# Altium schematic sheet ESP32_GATEWAY.SchDoc: ESP32 GATEWAY
size A3; Date: 30/1/2025; CheckedBy: Le Viet Trong; DrawnBy: Le Viet Trong; DocumentNumber: 1; SheetNumber: 1; SheetTotal: 1
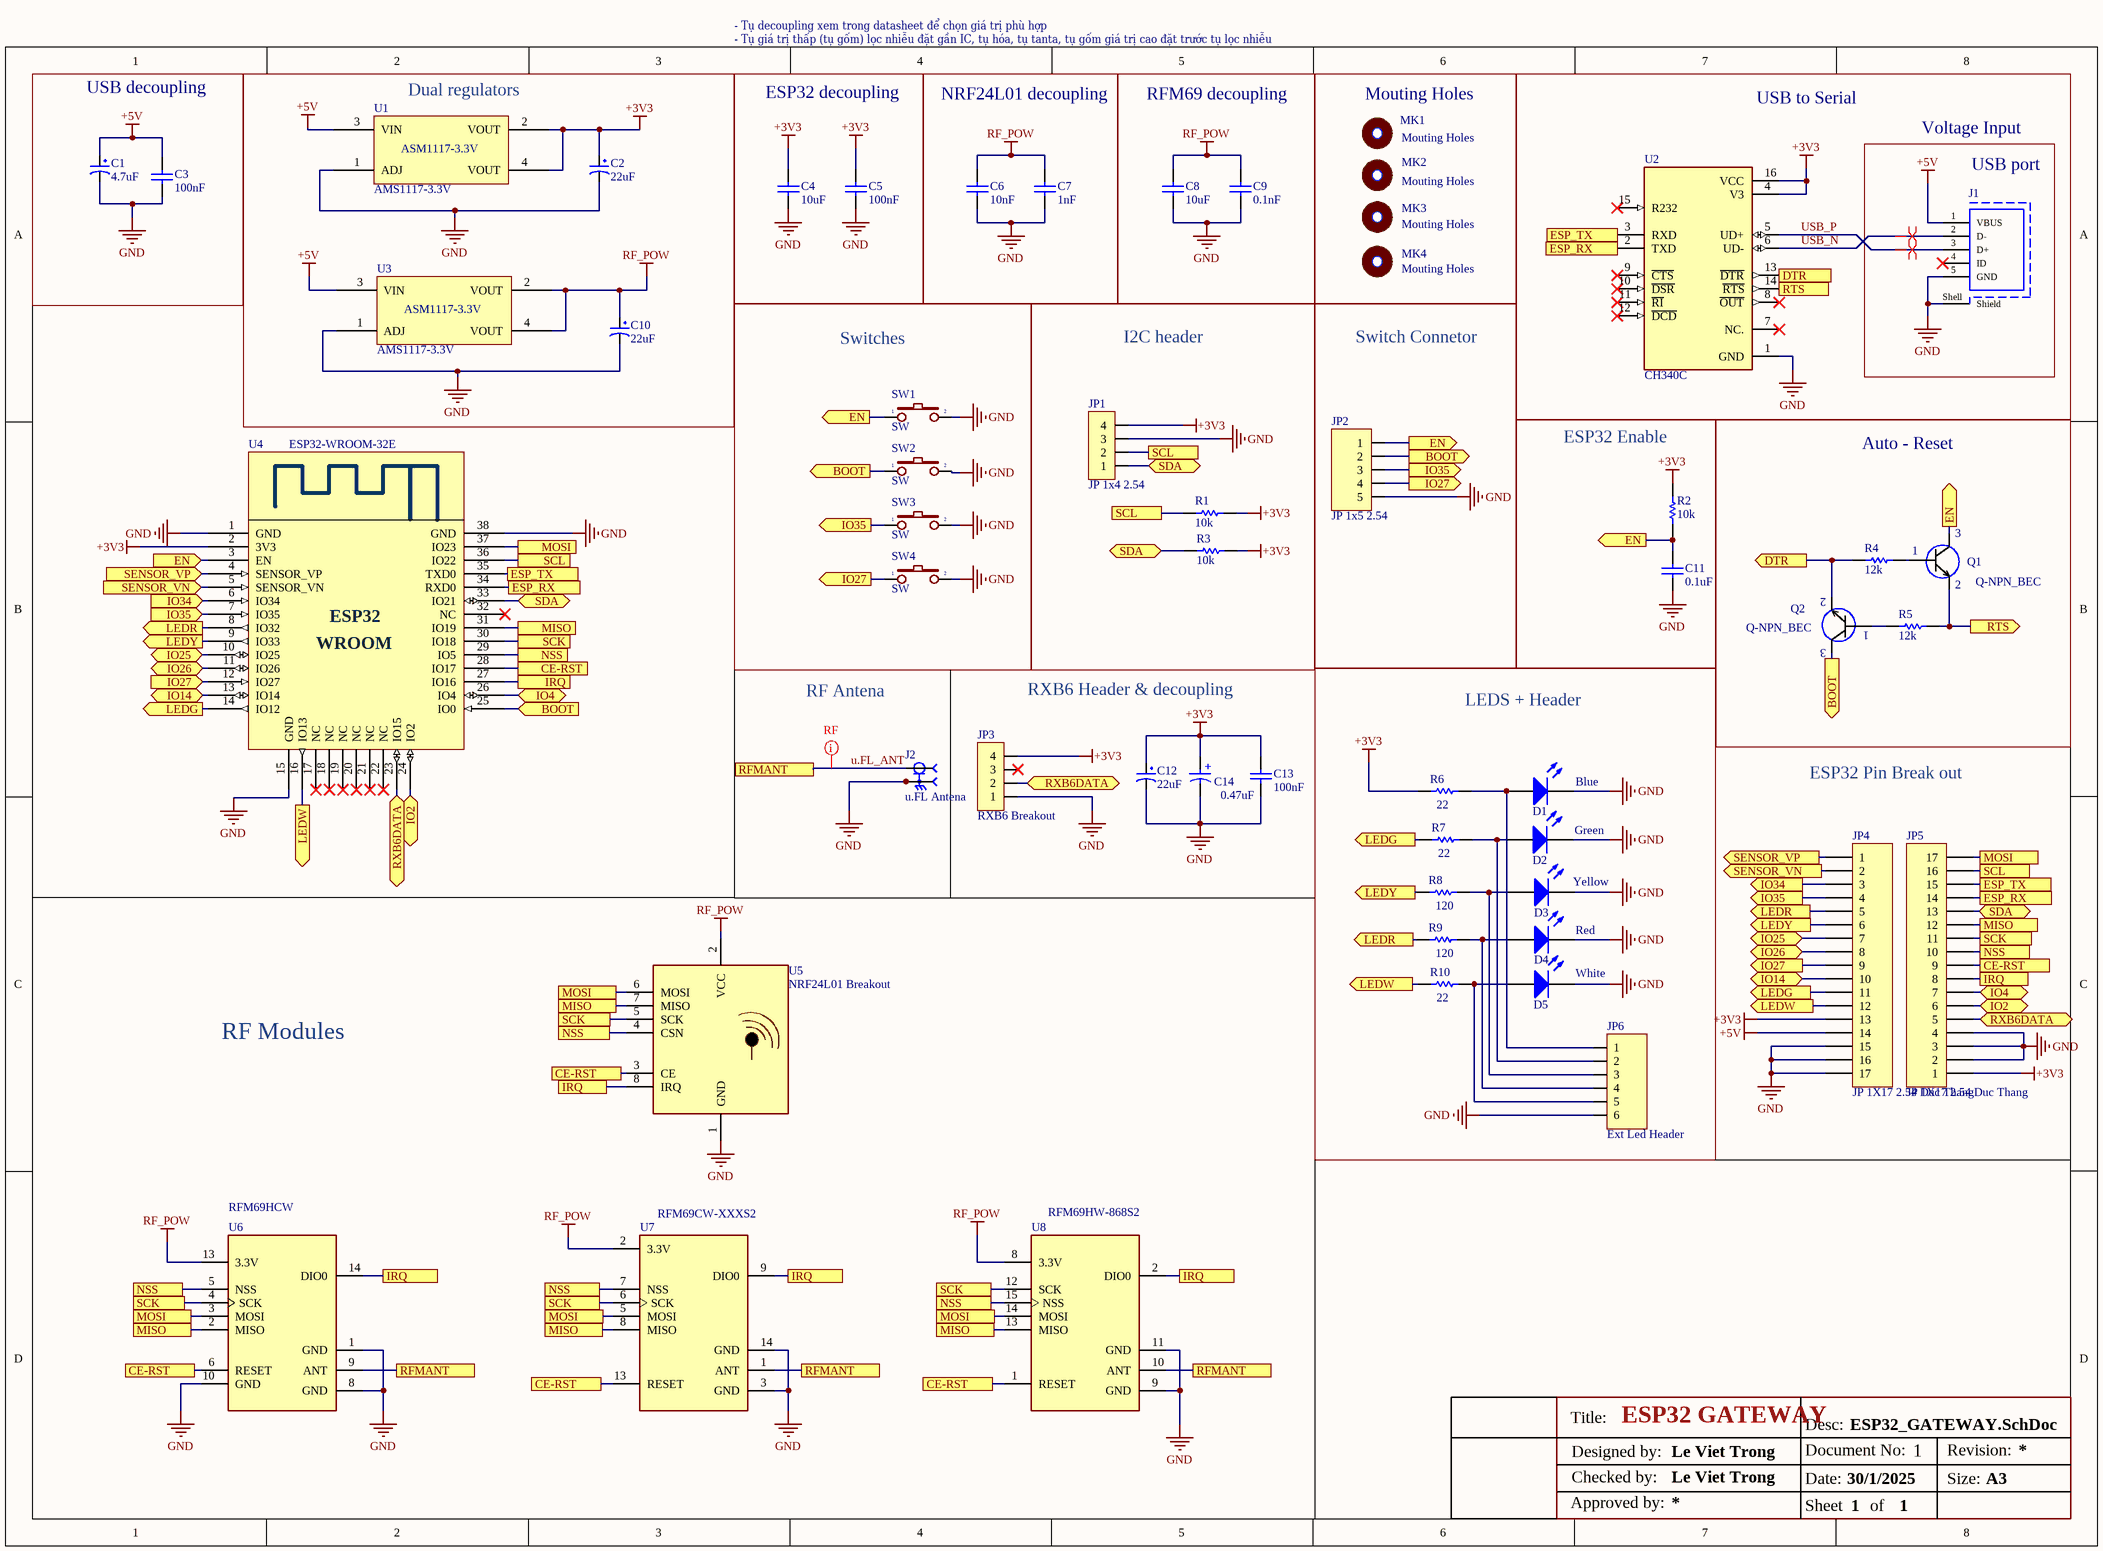
[diagram p0: ESP32_GATEWAY.SchDoc]

## Parts
C1  4.7uF  [Tu tanta 1206]
C2  22uF  [Tu tanta 1206]
C3  100nF  [CAP_0603]
C4  10uF  [CAP_0603]
C5  100nF  [CAP_0603]
C6  10nF  [CAP_0603]
C7  1nF  [CAP_0603]
C8  10uF  [CAP_0603]
C9  0.1nF  [CAP_0603]
C10  22uF  [Tu tanta 1206]
C11  0.1uF  [CAP_0603]
C12  22uF  [Tu tanta 1206]
C13  100nF  [CAP_0603]
C14  0.47uF  [WCAP-ASLI_D4H5.5]
D1  Blue  [LED_0805_Blue]
D2  Green  [LED_0805_Blue]
D3  Yellow  [LED_0805_Blue]
D4  Red  [LED_0805_Blue]
D5  White  [LED_0805_Blue]
J1  629105150521  [629105150521]  (value not drawn)
J2  u.FL Antena  [MOLEX_73412-0110]
JP1  JP 1x4 2.54  [JP 1X4 DT]
JP2  JP 1x5 2.54  [JP 1X5 DT]
JP3  RXB6 Breakout  [JP 1X4 DT]
JP4  JP 1X17 2.54 Duc Thang  [JP 1x17 DT]
JP5  JP 1X17 2.54 Duc Thang  [JP 1x17 DT]
JP6  Ext Led Header  [JP 1x6 DT]
MK1  Mouting Holes  [3mm]
MK2  Mouting Holes  [3mm]
MK3  Mouting Holes  [3mm]
MK4  Mouting Holes  [3mm]
Q1  Q-NPN_BEC  [SOT-23]
Q2  Q-NPN_BEC  [SOT-23]
R1  10k  [resistor_0603]
R2  10k  [resistor_0603]
R3  10k  [resistor_0603]
R4  12k  [resistor_0603]
R5  12k  [resistor_0603]
R6  22  [resistor_0603]
R7  22  [resistor_0603]
R8  120  [resistor_0603]
R9  120  [resistor_0603]
R10  22  [resistor_0603]
SW1  SW  [SW1-SMD]
SW2  SW  [SW1-SMD]
SW3  SW  [SW1-SMD]
SW4  SW  [SW1-SMD]
U1  AMS1117-3.3V  [AMS1117-3.3V SOT223]
U2  CH340C  [SOIC127P600X180-16N]
U3  AMS1117-3.3V  [AMS1117-3.3V SOT223]
U4  ESP32-WROOM-32E  [ESP32-WROOM]
U5  NRF24L01 Breakout  [NRF24L01 Breakout]
U6  RFM69HCW  [MOD_COM-13909]
U7  RFM69CW-XXXS2  [RFM69CW]
U8  RFM69HW-868S2  [XCVR_RFM69HW-868S2]

## Blocks framed on the sheet
USB decoupling: C1 C3
Dual regulators: C2 C10 U1 U3
ESP32 decoupling: C4 C5
NRF24L01 decoupling: C6 C7
RFM69 decoupling: C8 C9 MK1-MK4
Switches: SW1-SW4
I2C header: JP1 R1 R3
Switch Connetor: JP2
ESP32 Enable: C11 R2
Auto - Reset: Q1 Q2 R4 R5
LEDS + Header: D1-D5 JP6 R6-R10

## Ports
BOOT (in), BOOT (out), CE-RST, DTR (out), EN (in), EN (out), ESP_RX, ESP_TX, IO2 (bidir), IO4 (bidir), IO14 (bidir), IO25 (bidir), IO26 (bidir), IO27 (in), IO27 (out), IO34 (in), IO34 (out), IO35 (in), IO35 (out), IRQ, LEDG (out), LEDR (out), LEDW (out), LEDY (out), MISO, MOSI, NSS, RFMANT, RTS (out), RXB6DATA (bidir), SCK, SCL, SDA (bidir), SENSOR_VN (in), SENSOR_VN (out), SENSOR_VP (in), SENSOR_VP (out)

## Nets
+3V3: C2.1 C4.2 C5.2 C12.1 C13.2 C14.1(P) JP1.4 JP3.4 JP4.13 JP5.1 R1.2 R2.2 R3.2 R6.1 U1.2(VOUT) U1.4(VOUT) U2.4(V3) U2.16(VCC) U4.2(3V3)
+5V: C1.1 C3.2 J1.1(VBUS) JP4.14 U1.3(VIN) U3.3(VIN)
GND: C1.2 C2.2 C3.1 C4.1 C5.1 C6.1 C7.1 C8.1 C9.1 C10.2 C11.2 C12.2 C13.1 C14.2(N) D1.2(K) D2.2(K) D3.2(K) D4.2(K) D5.2(K) J1.5(GND) J1.Shell(Shield) J2.2(GND) J2.3(GND) J2.4(GND) JP1.3 JP2.5 JP3.1 JP4.15 JP4.16 JP4.17 JP5.2 JP5.3 JP5.4 JP6.6 SW1.2 SW2.2 SW3.2 SW4.2 U1.1(ADJ) U2.1(GND) U3.1(ADJ) U4.1(GND) U4.15(GND) U4.38(GND) U5.1(GND) U6.1(GND) U6.8(GND) U6.10(GND) U7.3(GND) U7.14(GND) U8.9(GND) U8.11(GND)
RF_POW: C6.2 C7.2 C8.2 C9.2 C10.1 U3.2(VOUT) U3.4(VOUT) U5.2(VCC) U6.13(3.3V) U7.2(3.3V) U8.8(3.3V)
BOOT: JP2.2 Q2.3 SW2.1 U4.25(IO0) ; port BOOT
CE-RST: JP5.9 U4.28(IO17) U5.3(CE) U6.6(RESET) U7.13(RESET) U8.1(RESET) ; port CE-RST
DTR: Q2.2 R4.1 U2.13(~{DTR}) ; port DTR
EN: C11.1 JP2.1 Q1.3 R2.1 SW1.1 U4.3(EN) ; port EN
ESP_RX: JP5.14 U2.2(TXD) U4.34(RXD0) ; port ESP_RX
ESP_TX: JP5.15 U2.3(RXD) U4.35(TXD0) ; port ESP_TX
IO2: JP5.6 U4.24(IO2) ; port IO2
IO4: JP5.7 U4.26(IO4) ; port IO4
IO14: JP4.10 U4.13(IO14) ; port IO14
IO25: JP4.7 U4.10(IO25) ; port IO25
IO26: JP4.8 U4.11(IO26) ; port IO26
IO27: JP2.4 JP4.9 SW4.1 U4.12(IO27) ; port IO27
IO34: JP4.3 U4.6(IO34) ; port IO34
IO35: JP2.3 JP4.4 SW3.1 U4.7(IO35) ; port IO35
IRQ: JP5.8 U4.27(IO16) U5.8(IRQ) U6.14(DIO0) U7.9(DIO0) U8.2(DIO0) ; port IRQ
LEDG: JP4.11 R7.1 U4.14(IO12) ; port LEDG
LEDR: JP4.5 R9.1 U4.8(IO32) ; port LEDR
LEDW: JP4.12 R10.1 U4.16(IO13) ; port LEDW
LEDY: JP4.6 R8.1 U4.9(IO33) ; port LEDY
MISO: JP5.12 U4.31(IO19) U5.7(MISO) U6.2(MISO) U7.8(MISO) U8.13(MISO) ; port MISO
MOSI: JP5.17 U4.37(IO23) U5.6(MOSI) U6.3(MOSI) U7.5(MOSI) U8.14(MOSI) ; port MOSI
NSS: JP5.10 U4.29(IO5) U5.4(CSN) U6.5(NSS) U7.7(NSS) U8.15(NSS) ; port NSS
RTS: Q1.2 R5.2 U2.14(~{RTS}) ; port RTS
RXB6DATA: JP3.2 JP5.5 U4.23(IO15) ; port RXB6DATA
SCK: JP5.11 U4.30(IO18) U5.5(SCK) U6.4(SCK) U7.6(SCK) U8.12(SCK) ; port SCK
SCL: JP1.2 JP5.16 R1.1 U4.36(IO22) ; port SCL
SDA: JP1.1 JP5.13 R3.1 U4.33(IO21) ; port SDA
SENSOR_VN: JP4.2 U4.5(SENSOR_VN) ; port SENSOR_VN
SENSOR_VP: JP4.1 U4.4(SENSOR_VP) ; port SENSOR_VP
u.FL_ANT: J2.1(SIG) U6.9(ANT) U7.1(ANT) U8.10(ANT) ; port RFMANT
USB_N: J1.2(D-) U2.6(UD-)
USB_P: J1.3(D+) U2.5(UD+)
NetD1_1: D1.1(A) D2.1(A) JP6.1 JP6.2 R6.2 R7.2
NetD3_1: D3.1(A) JP6.3 R8.2
NetD4_1: D4.1(A) JP6.4 R9.2
NetD5_1: D5.1(A) JP6.5 R10.2
NetQ1_1: Q1.1(B) R4.2
NetQ2_1: Q2.1(B) R5.1

Not connected (* = marked no-connect by the designer): J1 4(ID)*; JP3 3*; U2 7(NC.)* 8(~{OUT})* 9(~{CTS})* 10(~{DSR})* 11(~{RI})* 12(~{DCD})* 15(R232)*; U4 17(NC)* 18(NC)* 19(NC)* 20(NC)* 21(NC)* 22(NC)* 32(NC)*

## Layout directives
differential pair: USB_N, USB_P
mark named RF: u.FL_ANT

## Notes on the sheet
- - Tụ decoupling xem trong datasheet để chọn giá trị phù hợp
- - Tụ giá trị thấp (tụ gốm) lọc nhiễu đặt gần IC, tụ hóa, tụ tanta, tụ gốm giá trị cao đặt trước tụ lọc nhiễu
- Mouting Holes
- USB to Serial
- Voltage Input
- (near J1) USB port
- RXB6 Header & decoupling
- RF Antena
- ESP32 Pin Break out
- RF Modules
- 1
- Title:
- Desc:
- Designed by:
- Checked by:
- Date:
- Document No:
- Revision:
- Size:
- A3
- Approved by:
- Sheet
- of
- (in symbol 865080340003) +
- (in symbol AMS1117-3.3V) ASM1117-3.3V
- (in symbol ESP32-WROOM) WROOM

## Library data of the parts
C1 C2 C10 C12 = Tu tantalum 33uF 6.3V SMD3216: Dán; Don_Vi: Con; So_Chan: 2; Ten_Linh_Kien: Tụ tantalum J336-33uF 6.3V SMD3216; Ma_Hang: MH008674; Chung_Loai: Dán; Kieu_Chan: *
C3 C5 C13 = 01060310410: CAP, size 0603, 100nF; Supply 1 SN: 885012206095; Supply 1 name: Wurth Elektronik; Supply 2 name: Thegioiic; Capacitance Tolerance: +/-10%; ComponentLink1Description: Manufacturer; ComponentLink1URL: http://www.we-online.de; ComponentLink2Description: Datasheet; ComponentLink2URL: https://www.we-online.com/catalog/datasheet/885012206095.pdf; Operating Temperature: -55 to +125degC; Packaging: Tape and Reel; Supply 1 URL: https://www.we-online.com/en/components/products/WCAP-CSGP-50VDC?sq=885012206095R#885012206095R; Supply 2 SN: *; Supply 2 URL: https://www.thegioiic.com/tu-gom-0603-100nf-0-1uf-50v; Dissipation Factor: *; Height: *; Mounting Technology: SMT; Size: 0603; Capacitance: 100nF; Technical Reference: *
C4 C8 = 01060310010: CAP, size 0603,10uF; Supply 2 name: Thegioiic; Capacitance Tolerance: +/-10%; ComponentLink1Description: Manufacturer; ComponentLink1URL: *; ComponentLink2Description: Datasheet; ComponentLink2URL: *; Operating Temperature: -55 to +125degC; Packaging: Tape and Reel; Supply 1 SN: *; Supply 1 name: *; Supply 1 URL: *; Supply 2 SN: *; Supply 2 URL: https://www.thegioiic.com/tu-gom-0603-10uf-16v; Dissipation Factor: *; Height: *; Mounting Technology: SMT; Size: 0603; Capacitance: 10uF; Technical Reference: *
C6 = 01060310010: CAP, size 0603,10nF; Supply 2 name: Thegioiic; Capacitance Tolerance: +/-10%; Capacitance: 10uF; ComponentLink1Description: Manufacturer; ComponentLink1URL: *; ComponentLink2Description: Datasheet; ComponentLink2URL: *; Operating Temperature: -55 to +125degC; Packaging: Tape and Reel; Supply 1 SN: *; Supply 1 name: *; Supply 1 URL: *; Supply 2 SN: *; Supply 2 URL: https://www.thegioiic.com/tu-gom-0603-10uf-16v; Dissipation Factor: *; Height: *; Mounting Technology: SMT; Size: 0603; Technical Reference: *
C7 = 01060310010: CAP, size 0603,1nF; Supply 2 name: Thegioiic; Capacitance Tolerance: +/-10%; Capacitance: 10uF; ComponentLink1Description: Manufacturer; ComponentLink1URL: *; ComponentLink2Description: Datasheet; ComponentLink2URL: *; Operating Temperature: -55 to +125degC; Packaging: Tape and Reel; Supply 1 SN: *; Supply 1 name: *; Supply 1 URL: *; Supply 2 SN: *; Supply 2 URL: https://www.thegioiic.com/tu-gom-0603-10uf-16v; Dissipation Factor: *; Height: *; Mounting Technology: SMT; Size: 0603; Technical Reference: *
C9 C11 = 01060310010: CAP, size 0603, 0.1uF; Supply 2 name: Thegioiic; Capacitance Tolerance: +/-10%; Capacitance: 10uF; ComponentLink1Description: Manufacturer; ComponentLink1URL: *; ComponentLink2Description: Datasheet; ComponentLink2URL: *; Operating Temperature: -55 to +125degC; Packaging: Tape and Reel; Supply 1 SN: *; Supply 1 name: *; Supply 1 URL: *; Supply 2 SN: *; Supply 2 URL: https://www.thegioiic.com/tu-gom-0603-10uf-16v; Dissipation Factor: *; Height: *; Mounting Technology: SMT; Size: 0603; Technical Reference: *
C14 = 865080340003: V-Chip, D4 x H5.5mm, 22uF, 16V; Capacitance Tolerance: +/-20%; Dissipation Factor: 16%; Endurance: 2000h; Leakage Current: 3.52uA; Ripple Current: 90mA; Supply 1 Name: Mouser; Supply 1 SN: 710-865080340003; Supply 2 Name: thegioiic; Category: Aluminum Electrolytic Capacitors; ComponentLink2Description: Datasheet Link; ComponentLink2URL: https://www.we-online.com/redexpert/spec/865080340003?ad; Mount: Surface Mount; Operating Temperature Max: 105°C; Operating Temperature Min: -55°C; Packaging: Tape and Reel; Height: 5.5mm; Diameter: 4mm; Capacitance: 22uF; Rated Voltage (DC): 16V; Supply 1 URL: https://www.mouser.com/ProductDetail/Wurth-Elektronik/865080340003?qs=0KOYDY2FL2%252BowmC4S50IuQ%3D%3D; Supply 2 URL: https://www.thegioiic.com/tu-nhom-smd-22uf-16v-4x5-4mm
D1-D5 = LED SMD: LED
J1 = 629105150521: Micro USB 2.0 Type B Receptacle WR-COM, Horizontal, SMT, with Pegs, High Current at Pin 1 & Pin 5; Rated Current: 3 A; Contact Resistance: 30 mOhm; Working Voltage: 30 VAC; ComponentLink1Description: Manufacturer; ComponentLink1URL: http://www.we-online.de; ComponentLink2Description: Datasheet; ComponentLink2URL: https://katalog.we-online.de/em/datasheet/629105150521.pdf; Part Number: 629105150521; Published Date: September 2018; Publisher: Wurth Elektronik; Orientation: Horizontal; Connector Type: Micro USB 2.0 Type B; Operating Temperature: -40 to 85 degC; Mounting Technology: SMT; Gender: Receptacle; Packaging: Tape and Reel
J2 = 73412-0110: MF: {'manufacturer': u'Molex'}; Package: None; Price: None; Value: *; MP: 73412-0110; Availability: Unavailable
JP1 JP3 = JP 1x4 2.54 Duc Cong: Cắm; Ten_Linh_Kien: Jump Đơn Đực 2.54MM 1x40P Cong Đứng; Don_Vi: Con; Ma_Hang: MH000904; Ghi_Chu: *; Kieu_Chan: *; Chung_Loai: Cắm
JP2 = JP 1x5 2.54 Duc Cong: Cắm; Ten_Linh_Kien: Jump Đơn Đực 2.54MM 1x40P Cong Đứng; Don_Vi: Con; Ma_Hang: MH000904; Ghi_Chu: *; Kieu_Chan: *; Chung_Loai: Cắm
JP4 JP5 = JP 1X17 2.54 Duc Thang: Cắm; ComponentLink1Description: New link; ComponentLink1URL: *
JP6 = JP 1x6 2.54 Duc Thang: Cắm; Ten_Linh_Kien: Jump Đơn Đực 2.54MM 1x40P Thẳng 11MM; Don_Vi: Con; Ma_Hang: MH000903; Ghi_Chu: *; Kieu_Chan: *; Chung_Loai: Cắm
MK1-MK4 = Tooling Hole 3mm
Q1 Q2 = S8050 NPN: S8050 J3Y Transistor NPN 25V 0.5A 3 Chân SOT-23
R1-R3 R10 = 0006031031: RES, 10k Ohm, size 0603, 1%; Resistance Tolerant: +/-1%; Rated Power: 1/4W; Supply 1 Name: Mouser; Supply 1 SN: 755-ESR03EZPF1002; Supply 2 Name: Digikey; Supply 2 SN: RHM10KADTR-ND RHM10KADCT-ND RHM10KADDKR-ND; Resistance: 10k; Size: 0603; Mounting Technology: SMT; ComponentLink1Description: Datasheet link; ComponentLink1URL: https://fscdn.rohm.com/en/products/databook/datasheet/passive/resistor/chip_resistor/esr-e.pdf; ComponentLink2Description: Supply 1 URL; ComponentLink2URL: https://www.mouser.vn/ProductDetail/ROHM-Semiconductor/ESR03EZPF1002?qs=sGAEpiMZZMvdGkrng054t67Efho1F8r6CDeAsqwFse8%3D; ComponentLink3Description: Supply 2 URL; ComponentLink3URL: https://www.digikey.com/en/products/detail/rohm-semiconductor/ESR03EZPF1002/1983429
R4 R5 = 0006031031: RES, 12k Ohm, size 0603, 1%; Resistance: 10k; Resistance Tolerant: +/-1%; Rated Power: 1/4W; Supply 1 Name: Mouser; Supply 1 SN: 755-ESR03EZPF1002; Supply 2 Name: Digikey; Supply 2 SN: RHM10KADTR-ND RHM10KADCT-ND RHM10KADDKR-ND; Size: 0603; Mounting Technology: SMT; ComponentLink1Description: Datasheet link; ComponentLink1URL: https://fscdn.rohm.com/en/products/databook/datasheet/passive/resistor/chip_resistor/esr-e.pdf; ComponentLink2Description: Supply 1 URL; ComponentLink2URL: https://www.mouser.vn/ProductDetail/ROHM-Semiconductor/ESR03EZPF1002?qs=sGAEpiMZZMvdGkrng054t67Efho1F8r6CDeAsqwFse8%3D; ComponentLink3Description: Supply 2 URL; ComponentLink3URL: https://www.digikey.com/en/products/detail/rohm-semiconductor/ESR03EZPF1002/1983429
R6 R7 = 0006031031: RES, 22 Ohm, size 0603, 1%; Resistance: 10k; Resistance Tolerant: +/-1%; Rated Power: 1/4W; Supply 1 Name: Mouser; Supply 1 SN: 755-ESR03EZPF1002; Supply 2 Name: Digikey; Supply 2 SN: RHM10KADTR-ND RHM10KADCT-ND RHM10KADDKR-ND; Size: 0603; Mounting Technology: SMT; ComponentLink1Description: Datasheet link; ComponentLink1URL: https://fscdn.rohm.com/en/products/databook/datasheet/passive/resistor/chip_resistor/esr-e.pdf; ComponentLink2Description: Supply 1 URL; ComponentLink2URL: https://www.mouser.vn/ProductDetail/ROHM-Semiconductor/ESR03EZPF1002?qs=sGAEpiMZZMvdGkrng054t67Efho1F8r6CDeAsqwFse8%3D; ComponentLink3Description: Supply 2 URL; ComponentLink3URL: https://www.digikey.com/en/products/detail/rohm-semiconductor/ESR03EZPF1002/1983429
R8 R9 = 0006031031: RES, 120 Ohm, size 0603, 1%; Resistance: 10k; Resistance Tolerant: +/-1%; Rated Power: 1/4W; Supply 1 Name: Mouser; Supply 1 SN: 755-ESR03EZPF1002; Supply 2 Name: Digikey; Supply 2 SN: RHM10KADTR-ND RHM10KADCT-ND RHM10KADDKR-ND; Size: 0603; Mounting Technology: SMT; ComponentLink1Description: Datasheet link; ComponentLink1URL: https://fscdn.rohm.com/en/products/databook/datasheet/passive/resistor/chip_resistor/esr-e.pdf; ComponentLink2Description: Supply 1 URL; ComponentLink2URL: https://www.mouser.vn/ProductDetail/ROHM-Semiconductor/ESR03EZPF1002?qs=sGAEpiMZZMvdGkrng054t67Efho1F8r6CDeAsqwFse8%3D; ComponentLink3Description: Supply 2 URL; ComponentLink3URL: https://www.digikey.com/en/products/detail/rohm-semiconductor/ESR03EZPF1002/1983429
SW1-SW4 = SW2: Switch button 2 pin; Value: SW chip 2 pin
U1 U3 = AMS1117-3.3V: AMS1117-3.3V, OUT 3.3V 1A.; Manufacturer: AMS; Pad Count: 4; Current Output Maximum: 1A; Voltage Input Maximum: 15V; Manufacturer Part Number: *; Part Number: *; Current Input Maximum: *; Supplier 1 Link: *; Supplier 1 Name: *; Supplier 2 Link: *; Supplier 2 Name: *; Supplier 2 Part Number: *; Supplier 3 Link: https://www.thegioiic.com/ams1117-3-3v-ic-on-ap-3-3v-1a-sot-223; Supplier 3 Name: ThegioiIC; Supplier 3 Part Number: *; Voltage Output: 3.3V; Mounting Technology: SMD; Supplier 1 Part Number: *; Datasheet: http://www.advanced-monolithic.com/pdf/ds1117.pdf
U2 = CH340C: USB to serial chip CH340; MF: WCH; Price: None; Availability: Not in stock; MP: CH340C; Package: None; SnapEDA_Link: https://www.snapeda.com/parts/CH340C/WCH/view-part/?ref=snap; Check_prices: https://www.snapeda.com/parts/CH340C/WCH/view-part/?ref=eda; Value: *
U4 = ESP32-WROOM: Bluetooth, WiFi 802.11b/g/n, Bluetooth v4.2 +EDR, Class 1, 2 and 3 Transceiver Module 2.4GHz ~ 2.5GHz Integrated, Trace Surface Mount; Mfr: Espressif Systems; Utilized IC / Part: ESP32-D0WD-V3; Modulation: CCK, DSSS, OFDM; Data Rate: 150Mbps; Power - Output: 20dBm; Sensitivity: -98dBm; Serial Interfaces: ADC, GPIO, I²C, I²S, PWM, SDIO, SPI, UART; Memory Size: 4MB Flash, 448kB ROM, 536kB SRAM; Voltage - Supply: 3V ~ 3.6V; Category: RF and Wireless; Series: ESP32; RF Family/Standard: Bluetooth, WiFi; Protocol: 802.11b/g/n, Bluetooth v4.2 +EDR, Class 1, 2 and 3; Frequency: 2.4GHz ~ 2.5GHz; Antenna Type: Integrated, Trace; Mounting Type: Surface Mount; ComponentLink1Description: Hshop; ComponentLink1URL: https://hshop.vn/products/mach-thu-phat-wifi-ble-soc-esp32-v1; Operating Temperature: -40°C ~ 85°C; ComponentLink2Description: Datasheet; ComponentLink2URL: https://www.espressif.com/sites/default/files/russianDocumentation/esp32-wroom-32e_esp32-wroom-32ue_datasheet_en.pdf
U5 = NRF24L01: RF module
U6 = COM-13909: Rfm69hcw Wireless Transceiver 91; Value: *; MP: COM-13909; Package: None; Availability: Unavailable; Price: None
U7 = RFM69CW
U8 = RFM69HW-868S2: General ISM < 1GHz Transceiver Module 868MHz Antenna Not Included Surface Mount; MF: RF; Package: SMD-16 RF Solutions; Availability: Unavailable; MP: RFM69HW-868S2; Value: *; SnapEDA_Link: https://www.snapeda.com/parts/RFM69HW-868S2/RF%20Solutions/view-part/367203/?ref=snap; Price: None